# EAGLE design PCB__ARDUINO_APDS9960 (EAGLE 9.6.2)
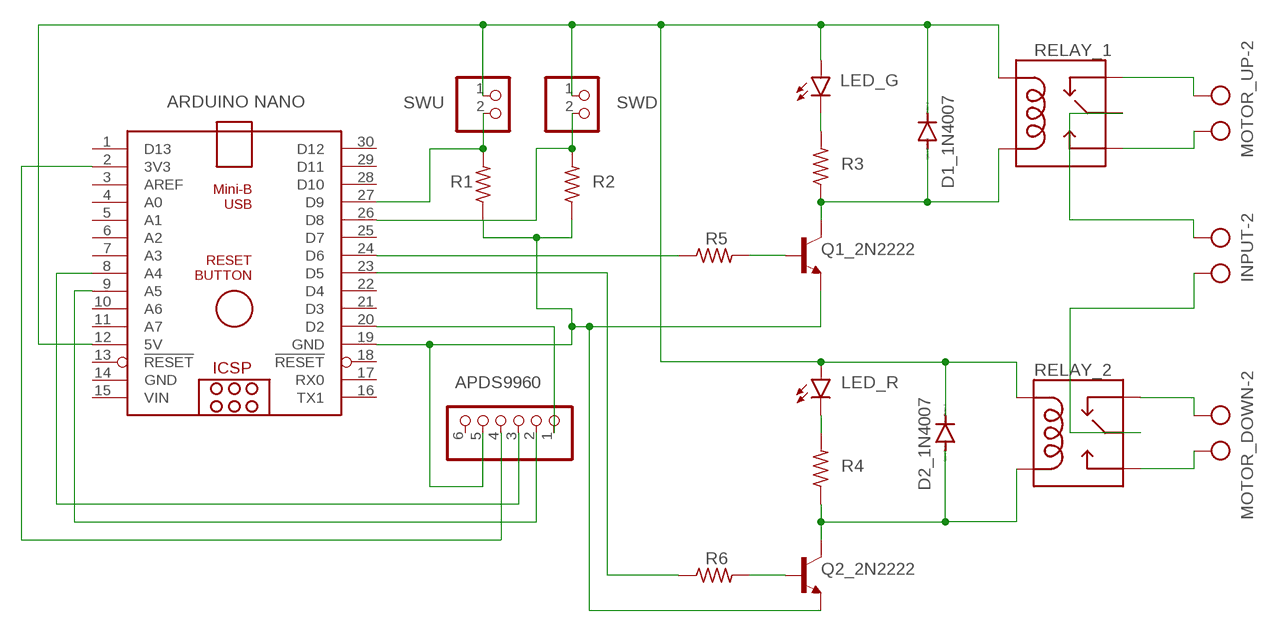
[diagram p0: schematic, sheet 1]

## Parts
APDS9960  PINHD-1X6  [1X06]
ARDUINO_NANO  ARDUINO NANO  ARDUINO_NANO  [ARDUINO_NANO]
D1_1N4007  1N4446  [DO35-10]
D2_1N4007  1N4446  [DO35-10]
INPUT  AK500/2  [AK500/2]
LED_G  TLLY4400  [LED3MM]
LED_R  TLLY4400  [LED3MM]
MOTOR_DOWN  AK500/2  [AK500/2]
MOTOR_UP  AK500/2  [AK500/2]
Q1_2N2222  2N3904  [TO92]
Q2_2N2222  2N3904  [TO92]
R1  R-US_0207/10  [0207/10]
R2  R-US_0207/10  [0207/10]
R3  R-US_0207/10  [0207/10]
R4  R-US_0207/10  [0207/10]
R5  R-US_0207/10  [0207/10]
R6  R-US_0207/10  [0207/10]
RELAY_1  RELAYPTH  [SRD-05VDC-SL-C]
RELAY_2  RELAYPTH  [SRD-05VDC-SL-C]
SWD  PINHD-1X2  [1X02]
SWU  PINHD-1X2  [1X02]

## Nets
N$1: D1_1N4007.A Q1_2N2222.1(C) R3.1 RELAY_1.COIL0
N$2: LED_G.K(C) R3.2
N$3: ARDUINO_NANO.27(D9) R1.2 SWU.2
N$4: ARDUINO_NANO.12(5V) D1_1N4007.C D2_1N4007.C LED_G.A LED_R.A RELAY_1.COIL1 RELAY_2.COIL1 SWD.1 SWU.1
N$5: LED_R.K(C) R4.2
N$6: D2_1N4007.A Q2_2N2222.1(C) R4.1 RELAY_2.COIL0
N$7: Q1_2N2222.2(B) R5.2
N$8: Q2_2N2222.2(B) R6.2
N$9: ARDUINO_NANO.24(D6) R5.1
N$10: MOTOR_DOWN.2 RELAY_2.SWCLOSED(SWCLOSE)
N$11: APDS9960.1 ARDUINO_NANO.20(D2)
N$12: APDS9960.4 ARDUINO_NANO.2(3V3)
N$13: APDS9960.2 ARDUINO_NANO.9(A5)
N$14: APDS9960.3 ARDUINO_NANO.8(A4)
N$15: ARDUINO_NANO.26(D8) R2.2 SWD.2
N$16: MOTOR_DOWN.1 RELAY_2.SWOPEN
N$17: ARDUINO_NANO.23(D5) R6.1
N$18: APDS9960.5 ARDUINO_NANO.19(GND) Q1_2N2222.3(E) Q2_2N2222.3(E) R1.1 R2.1
N$19: INPUT.1 RELAY_2.SWCOMMON
N$20: INPUT.2 RELAY_1.SWCOMMON
N$21: MOTOR_UP.2 RELAY_1.SWCLOSED(SWCLOSE)
N$22: MOTOR_UP.1 RELAY_1.SWOPEN
Unconnected: APDS9960.6 ARDUINO_NANO.1(D13) ARDUINO_NANO.3(AREF) ARDUINO_NANO.4(A0) ARDUINO_NANO.5(A1) ARDUINO_NANO.6(A2) ARDUINO_NANO.7(A3) ARDUINO_NANO.10(A6) ARDUINO_NANO.11(A7) ARDUINO_NANO.13(!RESET) ARDUINO_NANO.16(TX1) ARDUINO_NANO.17(RX0) ARDUINO_NANO.18(!RESET) ARDUINO_NANO.21(D3) ARDUINO_NANO.22(D4) ARDUINO_NANO.25(D7) ARDUINO_NANO.28(D10) ARDUINO_NANO.29(D11) ARDUINO_NANO.30(D12)

## Power pins joined to a net without a drawn wire
GND: ARDUINO_NANO.14(GND)
VIN: ARDUINO_NANO.15(VIN)

## Library data of the parts
APDS9960 = pinhead:PINHD-1X6: PIN HEADER
ARDUINO_NANO = A_ArduinoNanoV30:ARDUINO_NANO: Arduino Nano V3.0 Overview: The Arduino Nano is a small, complete, and breadboard-friendly board based on the ATmega328 (Arduino Nano 3.x) or ATmega168 (Arduino Nano 2.x). It has more or less the same functionality of the Arduino Duemilanove, but in a different package. It lacks only a DC power jack, and works with a Mini-B USB cable instead of a standard one. The Nano was designed and is being produced by Gravitech. Specifications: Microcontroller Atmel ATmega168 or ATmega328 Operating Voltage (logic level) 5 V Input Voltage (recommended) 7-12 V Input Voltage (limits) 6-20 V Digital I/O Pins 14 (of which 6 provide PWM output) Analog Input Pins 8 DC Current per I/O Pin 40 mA Flash Memory 16 KB (ATmega168) or 32 KB (ATmega328) of which 2 KB used by bootloader SRAM 1 KB (ATmega168) or 2 KB (ATmega328) EEPROM 512 bytes (ATmega168) or 1 KB (ATmega328) Clock Speed 16 MHz Dimensions 0.73" x 1.70" Length 45 mm Width 18 mm Weigth 5 g Power: The Arduino Nano can be powered via the Mini-B USB connection, 6-20V unregulated external power supply (pin 30), or 5V regulated external power supply (pin 27). The power source is automatically selected to the highest voltage source. Memory: The ATmega168 has 16 KB of flash memory for storing code (of which 2 KB is used for the bootloader); the ATmega328 has 32 KB, (also with 2 KB used for the bootloader). The ATmega168 has 1 KB of SRAM and 512 bytes of EEPROM (which can be read and written with the EEPROM library); the ATmega328 has 2 KB of SRAM and 1 KB of EEPROM. Input and Output: Each of the 14 digital pins on the Nano can be used as an input or output, using pinMode(), digitalWrite(), and digitalRead() functions. They operate at 5 volts. Each pin can provide or receive a maximum of 40 mA and has an internal pull-up resistor (disconnected by default) of 20-50 kOhms. In addition, some pins have specialized functions. Visit Arduino - ArduinoBoardNano <https://www.arduino.cc/en/Main/ArduinoBoardNano>
D1_1N4007 D2_1N4007 = diode:1N4446: DIODE high speed (Philips)
INPUT MOTOR_DOWN MOTOR_UP = con-ptr500:AK500/2: CONNECTOR; OC_FARNELL: unknown; OC_NEWARK: unknown
LED_G LED_R = led:TLLY4400: Low Current (2mA) LED 3 mm Tinted Diffused Package color YELLOW Source: Data sheet <http://www.farnell.com/datasheets/391098.pdf>; MF: VISHAY SEMICONDUCTOR; OC_FARNELL: 1612439
Q1_2N2222 Q2_2N2222 = transistor-npn:2N3904: NPN Transistor
R1-R6 = rcl:R-US_: RESISTOR, American symbol; SPICEPREFIX: R
RELAY_1 RELAY_2 = SRD-05VDC-SL-C:RELAY: SPDT relay (COM-00101)
SWD SWU = pinhead:PINHD-1X2: PIN HEADER

## Board
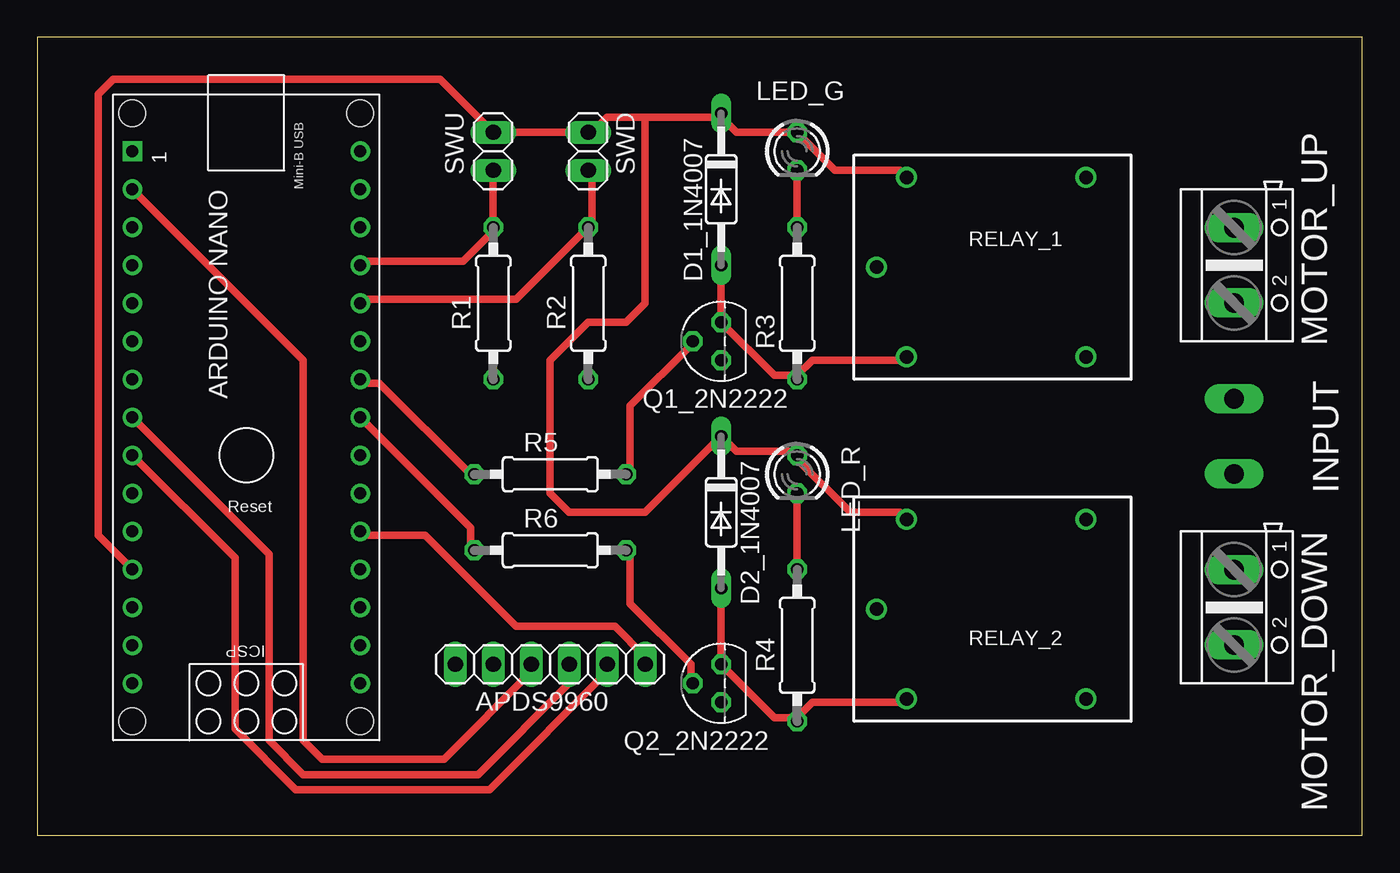
[diagram p1: board, top side]
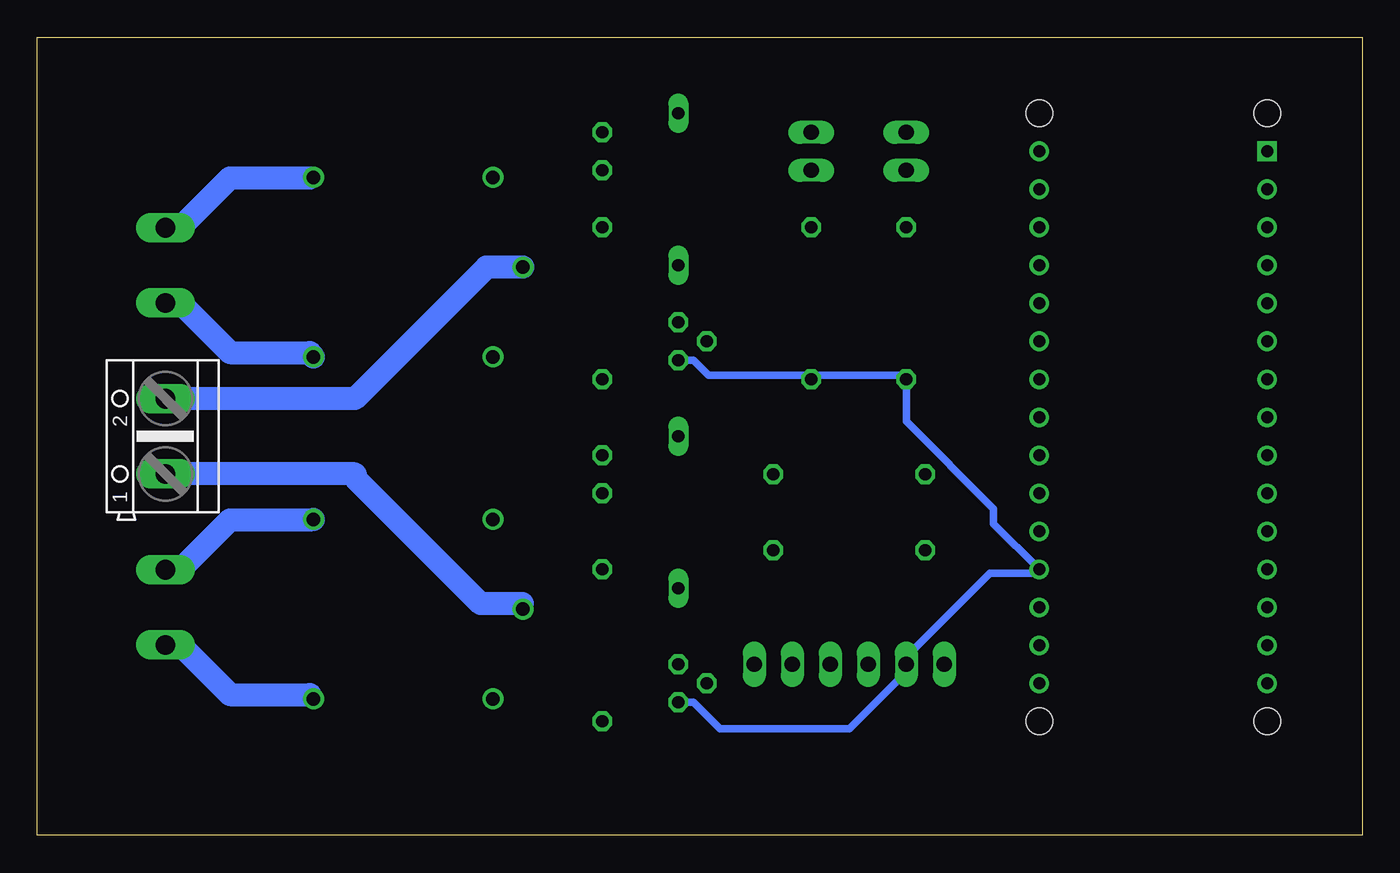
[diagram p2: board, bottom side, seen from below]

Size 88.57 x 53.33 mm. Coordinates in mm from the lower left corner, seen from the top.
Outline: 0,0 88.57,0 88.57,53.33 0,53.33 0,0
Copper layers (1*16): Top 0.06mm / dielectric 1.5mm / Bottom 0.06mm
Design rules "Pedro": minimum track width 20mil, minimum drill 0.35mm, track to track 20mil, track to pad 20mil, pad to pad 20mil, via to via 20mil, smd to smd 20mil, copper to edge 35mil, drill to drill 6mil, minimum pad ring 10mil, minimum via ring 8mil, stop-mask expansion 4mil, vias tented up to drill 0mil, thermal gap 10mil

### Footprints (pad centres in the part's own frame; a part is rotated, then mirrored left to right if it is on the bottom)
1X06 = drill 1.016 long: 1 -6.35,0; 2 -3.81,0; 3 -1.27,0; 4 1.27,0; 5 3.81,0; 6 6.35,0
ARDUINO_NANO = drill 0.8 square: 1 -20.32,-7.62 | drill 0.8: 2 -17.78,-7.62; 3 -15.24,-7.62; 4 -12.7,-7.62; 5 -10.16,-7.62; 6 -7.62,-7.62; 7 -5.08,-7.62; 8 -2.54,-7.62; 9 0,-7.62; 10 2.54,-7.62; 11 5.08,-7.62; 12 7.62,-7.62; 13 10.16,-7.62; 14 12.7,-7.62; 15 15.24,-7.62; 16 15.24,7.62; 17 12.7,7.62; 18 10.16,7.62; 19 7.62,7.62; 20 5.08,7.62; 21 2.54,7.62; 22 0,7.62; 23 -2.54,7.62; 24 -5.08,7.62; 25 -7.62,7.62; 26 -10.16,7.62; 27 -12.7,7.62; 28 -15.24,7.62; 29 -17.78,7.62; 30 -20.32,7.62 | hole 1.778: -22.86,-7.62; -22.86,7.62; 17.78,7.62; 17.78,-7.62
DO35-10 = drill 0.813 long: A 5.08,0; C -5.08,0
AK500/2 = drill 1.321 long: 1 -2.515,0; 2 2.515,0
LED3MM = drill 0.813 octagon: A -1.27,0; K 1.27,0
TO92 = drill 0.813 octagon: 1 1.27,0; 2 0,1.905; 3 -1.27,0
0207/10 = drill 0.813 octagon: 1 -5.08,0; 2 5.08,0
SRD-05VDC-SL-C = drill 0.9: COIL0 -5.39,-6.12; COIL1 -5.39,5.88; SWCLOSED 6.61,-6.12; SWCOMMON -7.39,-0.12; SWOPEN 6.61,5.88
1X02 = drill 1.016 long: 1 -1.27,0; 2 1.27,0

### Placement (x,y rotation side)
APDS9960  34.29,11.43 180 top
ARDUINO_NANO  13.97,25.4 270 top
D1_1N4007  45.72,43.18 270 top
D2_1N4007  45.72,21.59 270 top
INPUT  80.01,26.67 90 bottom
LED_G  50.8,45.72 270 top
LED_R  50.8,24.13 270 top
MOTOR_DOWN  80.01,15.24 270 top
MOTOR_UP  80.01,38.1 270 top
Q1_2N2222  45.72,33.02 90 top
Q2_2N2222  45.72,10.16 90 top
R1  30.48,35.56 90 top
R2  36.83,35.56 90 top
R3  50.8,35.56 90 top
R4  50.8,12.7 90 top
R5  34.29,24.13 0 top
R6  34.29,19.05 0 top
RELAY_1  63.5,38.1 0 top
RELAY_2  63.5,15.24 0 top
SWD  36.83,45.72 270 top
SWU  30.48,45.72 270 top

### Tracks (layer width: path | path; a pad name or v marks a point on that pad's centre or on a via)
N$1
  Top 0.508: 50.8,30.73 49.28,30.73 Q1_2N2222.1 D1_1N4007.A | 50.8,30.73 51.82,31.75 57.66,31.75 RELAY_1.COIL0 | 50.8,30.73 R3.1
N$2
  Top 0.508: LED_G.K R3.2
N$3
  Top 0.508: ARDUINO_NANO.27 21.84,38.35 28.45,38.35 30.48,40.39 R1.2 SWU.2
N$4
  Top 0.508: RELAY_2.COIL1 57.66,21.59 54.36,21.59 50.8,25.15 LED_R.A 50.8,25.65 46.74,25.65 D2_1N4007.C 40.64,21.59 35.56,21.59 34.29,22.86 34.29,31.75 36.83,34.29 39.37,34.29 40.64,35.56 40.64,48.01 | 45.72,48.01 46.74,46.99 LED_G.A 53.34,44.45 57.66,44.45 RELAY_1.COIL1 | ARDUINO_NANO.12 4.06,20.07 4.06,49.53 5.08,50.55 26.92,50.55 SWU.1 SWD.1 37.08,46.99 38.1,48.01 40.64,48.01 | 40.64,48.01 45.72,48.01 | 45.72,48.01 D1_1N4007.C
N$5
  Top 0.508: LED_R.K R4.2
N$6
  Top 0.508: 50.8,7.87 49.28,7.87 Q2_2N2222.1 D2_1N4007.A | 50.8,7.87 51.82,8.89 57.66,8.89 RELAY_2.COIL0 | 50.8,7.87 R4.1
N$7
  Top 0.508: R5.2 39.62,24.13 39.62,28.7 43.69,32.77 Q1_2N2222.2
N$8
  Top 0.508: R6.2 39.62,19.05 39.62,15.49 43.69,11.43 43.69,10.41 Q2_2N2222.2
N$9
  Top 0.508: ARDUINO_NANO.24 21.84,30.23 22.86,30.23 28.96,24.13 R5.1
N$10
  Bottom 0.508: 70.36,9.4 RELAY_2.SWCLOSED
  Bottom 1.524: 70.36,9.4 75.69,9.4 79.02,12.72 MOTOR_DOWN.2
N$11
  Top 0.508: APDS9960.1 40.64,11.94 38.61,13.97 32,13.97 25.91,20.07 21.84,20.07 ARDUINO_NANO.20
N$12
  Top 0.508: ARDUINO_NANO.2 17.78,31.75 17.78,6.35 19.05,5.08 27.18,5.08 33.02,10.92 APDS9960.4
N$13
  Top 0.508: ARDUINO_NANO.9 13.21,18.54 13.21,7.11 17.27,3.05 30.23,3.05 38.1,10.92 APDS9960.2
N$14
  Top 0.508: ARDUINO_NANO.8 15.49,18.8 15.49,6.35 17.78,4.06 29.46,4.06 35.56,10.16 APDS9960.3
N$15
  Top 0.508: ARDUINO_NANO.26 21.84,35.81 32,35.81 R2.2 37.08,40.89 37.08,44.45 SWD.2
N$16
  Bottom 1.524: RELAY_2.SWOPEN 70.36,21.08 75.69,21.08 79.02,17.75 MOTOR_DOWN.1
N$17
  Top 0.508: ARDUINO_NANO.23 28.96,20.57 28.96,19.05 R6.1
N$18
  Bottom 0.508: Q1_2N2222.3 44.7,31.75 43.69,30.73 37.08,30.73 R2.1 36.58,30.73 30.48,30.73 R1.1 30.48,27.69 24.64,21.84 24.64,20.83 ARDUINO_NANO.19 21.84,17.53 24.89,17.53 30.48,11.94 APDS9960.5 30.48,10.92 34.29,7.11 42.93,7.11 44.7,8.89 Q2_2N2222.3
N$19
  Bottom 0.508: 56.13,15.49 RELAY_2.SWCOMMON
  Bottom 1.524: 56.13,15.49 58.93,15.49 67.31,23.88 67.31,24.13 67.33,24.16 INPUT.1
N$20
  Bottom 1.524: RELAY_1.SWCOMMON 58.54,37.98 67.33,29.19 INPUT.2
N$21
  Bottom 1.524: RELAY_1.SWCLOSED 70.36,32.26 75.69,32.26 78.99,35.56 79.98,35.56 MOTOR_UP.2
N$22
  Bottom 0.508: 70.36,43.94 RELAY_1.SWOPEN
  Bottom 1.524: 70.36,43.94 75.69,43.94 79.02,40.62 MOTOR_UP.1